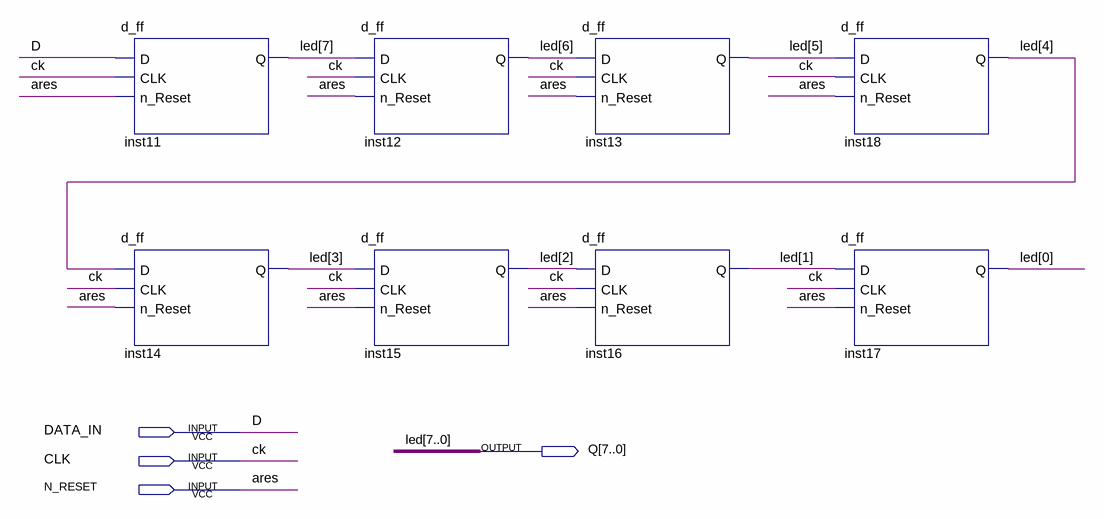
[diagram p0: schematic sheet]
// Quartus schematic cascaded_dff.bdf as structural Verilog: 8 symbols, 4 pins
module cascaded_dff (
  input  DATA_IN,
  input  CLK,
  input  N_RESET,
  output [7:0] Q
);

  d_ff inst11 (.D(DATA_IN), .CLK(CLK), .n_Reset(N_RESET), .Q(Q[7]));
  d_ff inst14 (.D(Q[4]), .CLK(CLK), .n_Reset(N_RESET), .Q(Q[3]));
  d_ff inst12 (.D(Q[7]), .CLK(CLK), .n_Reset(N_RESET), .Q(Q[6]));
  d_ff inst15 (.D(Q[3]), .CLK(CLK), .n_Reset(N_RESET), .Q(Q[2]));
  d_ff inst13 (.D(Q[6]), .CLK(CLK), .n_Reset(N_RESET), .Q(Q[5]));
  d_ff inst16 (.D(Q[2]), .CLK(CLK), .n_Reset(N_RESET), .Q(Q[1]));
  d_ff inst18 (.D(Q[5]), .CLK(CLK), .n_Reset(N_RESET), .Q(Q[4]));
  d_ff inst17 (.D(Q[1]), .CLK(CLK), .n_Reset(N_RESET), .Q(Q[0]));

  // Other names for the same wires on the sheet: ares = N_RESET; ck = CLK; D = DATA_IN; led[7:0] = Q
endmodule
